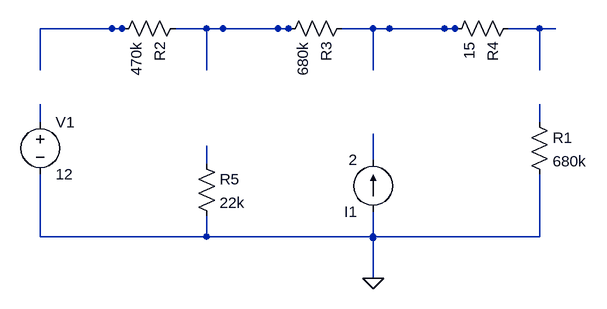
[diagram p0: schematic pannel1.asc]
pannel1.asc, the LTspice schematic file:
Version 4
SHEET 1 880 680
WIRE 784 256 857 256
WIRE 686 256 702 256
SYMBOL res 800 240 R90
SYMATTR InstName R3
SYMATTR Value 680k
WIRE 1040 256 1113 256
WIRE 942 256 958 256
SYMBOL res 1056 240 R90
SYMATTR InstName R4
SYMATTR Value 15
WIRE 576 464 576 436
WIRE 576 576 576 544
SYMBOL res 560 448 R0
SYMATTR InstName R5
SYMATTR Value 22k
WIRE 528 256 601 256
WIRE 430 256 446 256
SYMBOL res 544 240 R90
SYMATTR InstName R2
SYMATTR Value 470k
WIRE 1088 400 1088 372
WIRE 1088 512 1088 480
SYMBOL res 1072 384 R0
SYMATTR InstName R1
SYMATTR Value 680k
WIRE 832 538 832 578
WIRE 832 418 832 458
SYMBOL current 832 538 R180
SYMATTR InstName I1
SYMATTR Value 2
FLAG 832 640 0
WIRE 320 400 320 372
WIRE 320 512 320 480
SYMBOL voltage 320 384 R0
SYMATTR InstName V1
SYMATTR Value 12
WIRE 1088 256 1088 320
WIRE 576 256 576 320
WIRE 576 256 640 256
WIRE 832 256 832 320
WIRE 832 256 896 256
WIRE 1024 576 1088 576
WIRE 1088 512 1088 576
WIRE 320 512 320 576
WIRE 320 576 384 576
WIRE 512 576 576 576
WIRE 576 576 640 576
WIRE 768 576 832 576
WIRE 832 576 832 640
WIRE 832 576 896 576
WIRE 320 256 320 320
WIRE 320 256 384 256
WIRE 640 256 704 256
WIRE 896 256 960 256
WIRE 960 576 1024 576
WIRE 896 576 960 576
WIRE 704 576 768 576
WIRE 640 576 704 576
WIRE 448 576 512 576
WIRE 384 576 448 576
WIRE 384 256 448 256

The netlist it stands for:
* pannel1.asc
R3 N001 N002 680k
R4 N003 N001 15
R5 N004 0 22k
R2 N002 N005 470k
R1 N006 0 680k
I1 0 N007 2
V1 N008 0 12
.backanno
.end